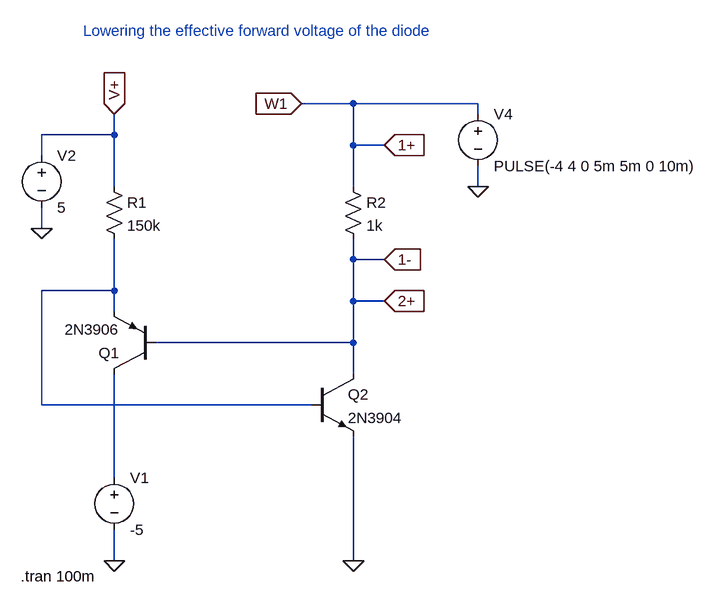
[diagram p0: schematic low_eff_vdrop.asc]
low_eff_vdrop.asc, the LTspice schematic file:
Version 4
SHEET 1 916 680
WIRE 368 -240 288 -240
WIRE 560 -240 368 -240
WIRE 560 -224 560 -240
WIRE 0 -192 0 -224
WIRE 0 -192 -112 -192
WIRE 368 -176 368 -240
WIRE 416 -176 368 -176
WIRE -112 -160 -112 -192
WIRE 0 -112 0 -192
WIRE 368 -112 368 -176
WIRE 560 -112 560 -144
WIRE -112 -48 -112 -80
WIRE 368 0 368 -32
WIRE 416 0 368 0
WIRE 0 48 0 -32
WIRE 0 48 -112 48
WIRE 368 64 368 0
WIRE 416 64 368 64
WIRE 0 80 0 48
WIRE 368 128 368 64
WIRE 368 128 64 128
WIRE 368 176 368 128
WIRE -112 224 -112 48
WIRE 304 224 -112 224
WIRE 0 336 0 176
WIRE 0 464 0 416
WIRE 368 464 368 272
FLAG 0 464 0
FLAG -112 -48 0
FLAG 560 -112 0
FLAG 368 464 0
FLAG 0 -224 V+
IOPIN 0 -224 In
FLAG 416 -176 1+
IOPIN 416 -176 In
FLAG 416 0 1-
IOPIN 416 0 In
FLAG 288 -240 W1
IOPIN 288 -240 In
FLAG 416 64 2+
IOPIN 416 64 In
SYMBOL res -16 -128 R0
SYMATTR InstName R1
SYMATTR Value 150k
SYMBOL pnp 64 176 R180
SYMATTR InstName Q1
SYMATTR Value 2N3906
SYMBOL voltage 0 320 R0
WINDOW 123 0 0 Left 0
WINDOW 39 0 0 Left 0
SYMATTR InstName V1
SYMATTR Value -5
SYMBOL voltage -112 -176 R0
WINDOW 123 0 0 Left 0
WINDOW 39 0 0 Left 0
SYMATTR InstName V2
SYMATTR Value 5
SYMBOL npn 304 176 R0
SYMATTR InstName Q2
SYMATTR Value 2N3904
SYMBOL res 352 -128 R0
SYMATTR InstName R2
SYMATTR Value 1k
SYMBOL voltage 560 -240 R0
WINDOW 123 0 0 Left 0
WINDOW 39 0 0 Left 0
SYMATTR InstName V4
SYMATTR Value PULSE(-4 4 0 5m 5m 0 10m)
TEXT -144 488 Left 2 !.tran 100m
TEXT -48 -352 Left 2 ;Lowering the effective forward voltage of the diode

The netlist it stands for:
* low_eff_vdrop.asc
R1 V+ N001 150k
Q1 N002 2+ N001 0 2N3906
V1 N002 0 -5
V2 V+ 0 5
Q2 2+ N001 0 0 2N3904
R2 W1 2+ 1k
V4 W1 0 PULSE(-4 4 0 5m 5m 0 10m)
.model NPN NPN
.model PNP PNP
.lib standard.bjt
.tran 100m
* Lowering the effective forward voltage of the diode
.backanno
.end